# Altium schematic sheet MPU.SchDoc
size A2
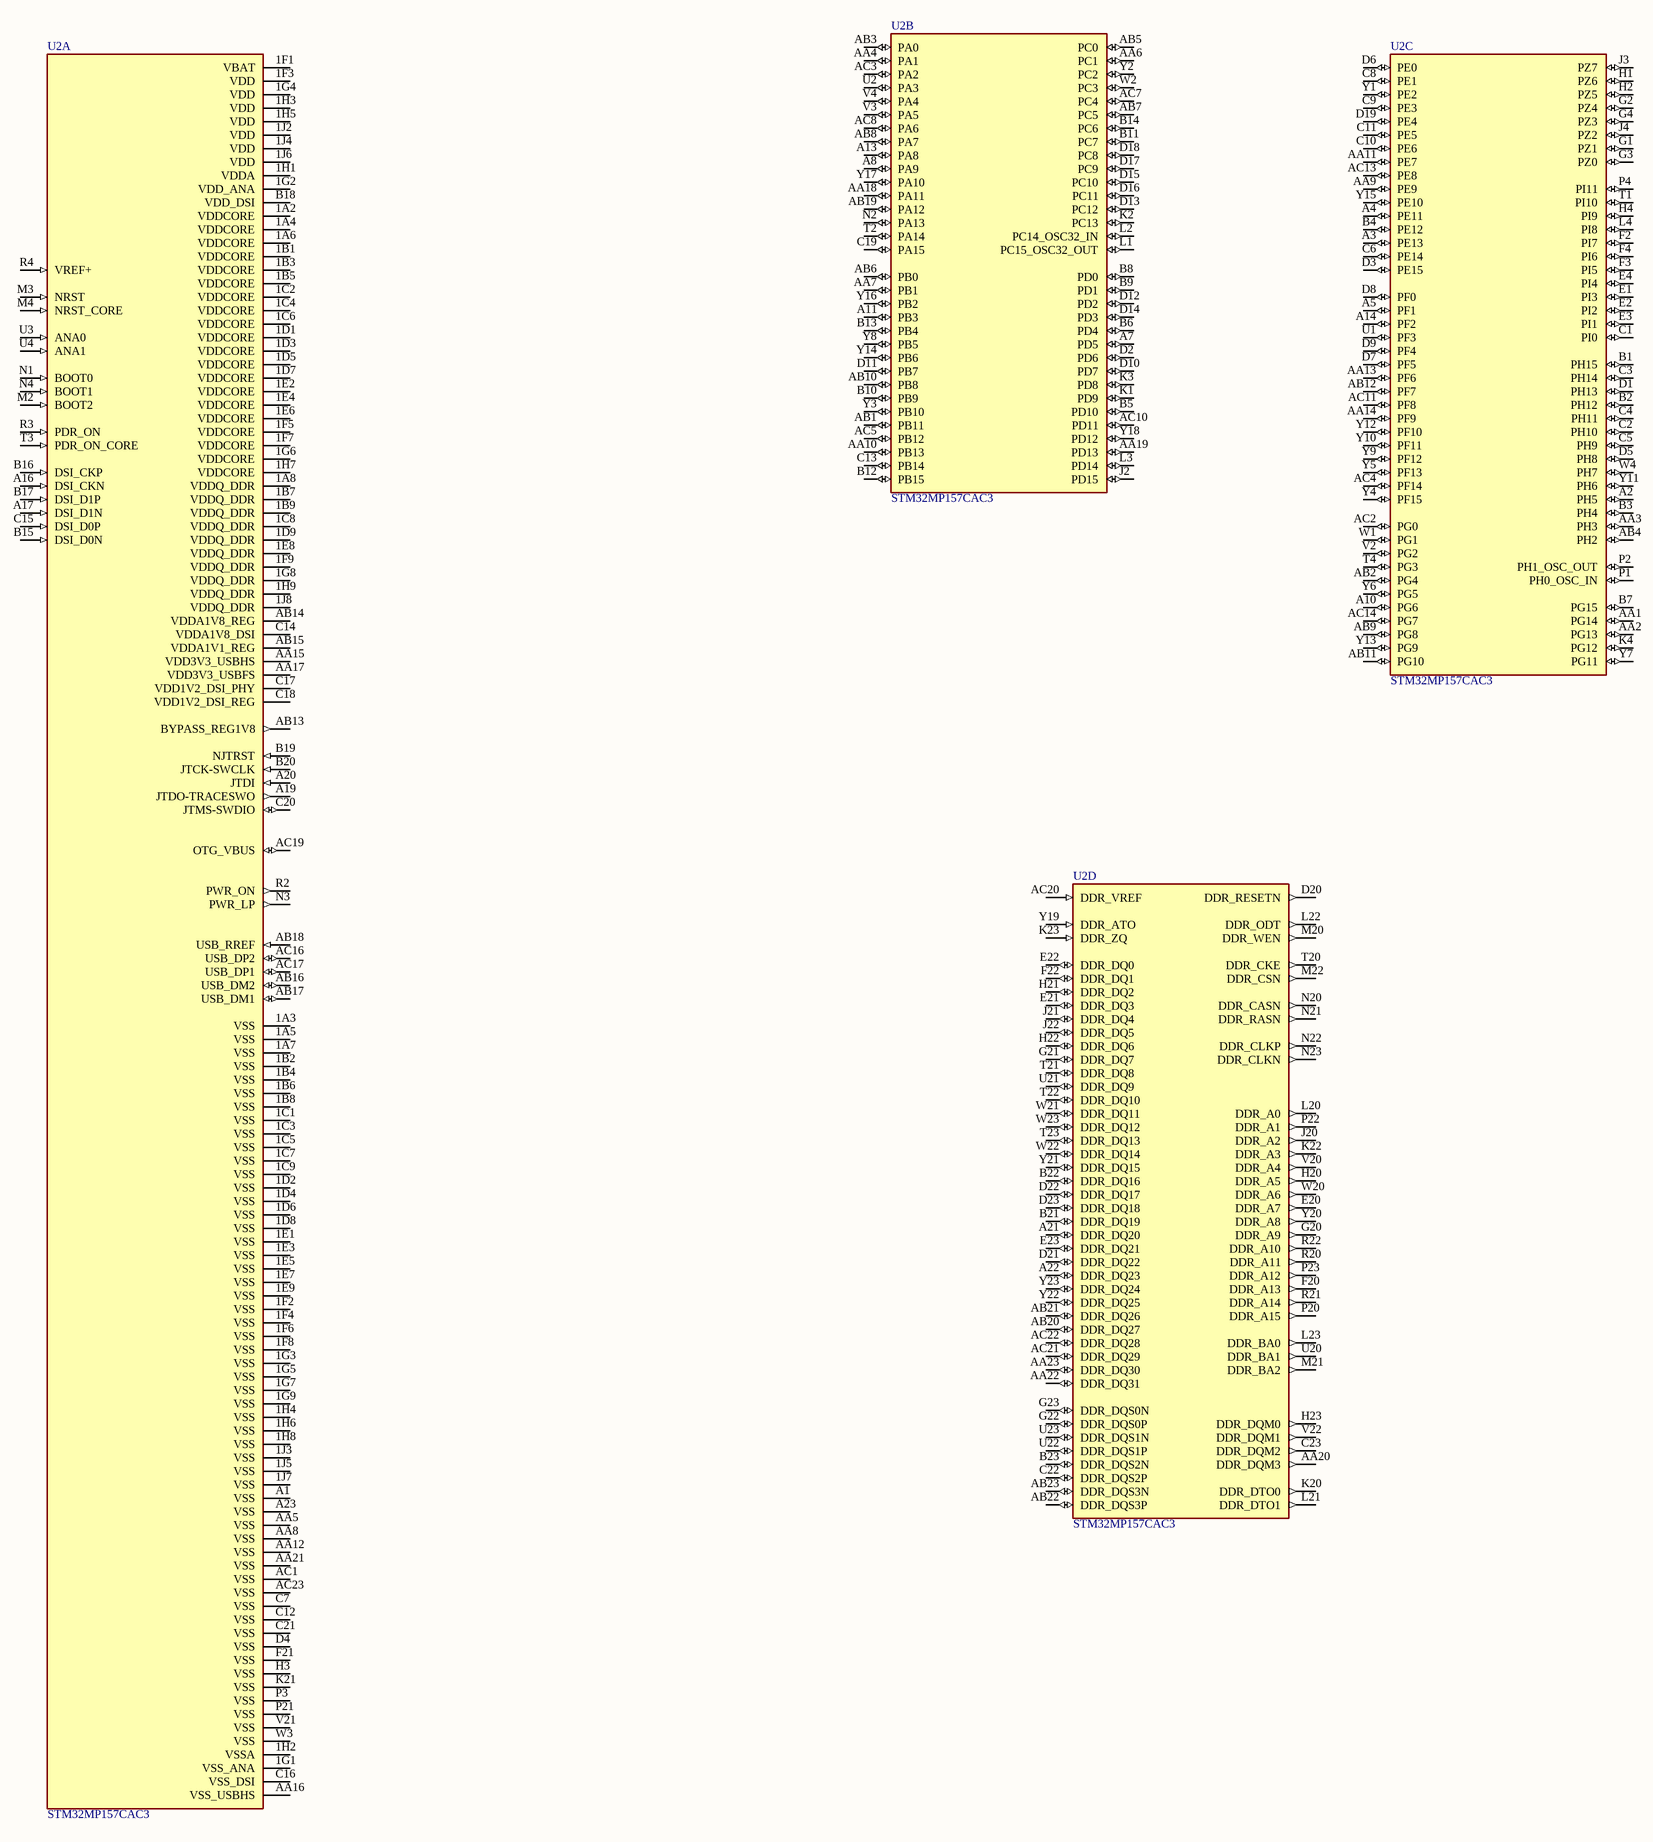
[diagram p0: MPU.SchDoc]

## Parts
U2  STM32MP157CAC3  [STM32MP157CAC3]  (parts A,B,C,D of 4)

## Nets

Not connected (* = marked no-connect by the designer): U2 1A2(VDDCORE) 1A3(VSS) 1A4(VDDCORE) 1A5(VSS) 1A6(VDDCORE) 1A7(VSS) 1A8(VDDQ_DDR) 1B1(VDDCORE) 1B2(VSS) 1B3(VDDCORE) 1B4(VSS) 1B5(VDDCORE) 1B6(VSS) 1B7(VDDQ_DDR) 1B8(VSS) 1B9(VDDQ_DDR) 1C1(VSS) 1C2(VDDCORE) 1C3(VSS) 1C4(VDDCORE) 1C5(VSS) 1C6(VDDCORE) 1C7(VSS) 1C8(VDDQ_DDR) 1C9(VSS) 1D1(VDDCORE) 1D2(VSS) 1D3(VDDCORE) 1D4(VSS) 1D5(VDDCORE) 1D6(VSS) 1D7(VDDCORE) 1D8(VSS) 1D9(VDDQ_DDR) 1E1(VSS) 1E2(VDDCORE) 1E3(VSS) 1E4(VDDCORE) 1E5(VSS) 1E6(VDDCORE) 1E7(VSS) 1E8(VDDQ_DDR) 1E9(VSS) 1F1(VBAT) 1F2(VSS) 1F3(VDD) 1F4(VSS) 1F5(VDDCORE) 1F6(VSS) 1F7(VDDCORE) 1F8(VSS) 1F9(VDDQ_DDR) 1G1(VSS_ANA) 1G2(VDD_ANA) 1G3(VSS) 1G4(VDD) 1G5(VSS) 1G6(VDDCORE) 1G7(VSS) 1G8(VDDQ_DDR) 1G9(VSS) 1H1(VDDA) 1H2(VSSA) 1H3(VDD) 1H4(VSS) 1H5(VDD) 1H6(VSS) 1H7(VDDCORE) 1H8(VSS) 1H9(VDDQ_DDR) 1J2(VDD) 1J3(VSS) 1J4(VDD) 1J5(VSS) 1J6(VDD) 1J7(VSS) 1J8(VDDQ_DDR) A1(VSS) A2(PH5) A3(PE13) A4(PE11) A5(PF1) A7(PD5) A8(PA9) A10(PG6) A11(PB3) A13(PA8) A14(PF2) A16(DSI_CKN) A17(DSI_D1N) A19(JTDO-TRACESWO) A20(JTDI) A21(DDR_DQ20) A22(DDR_DQ23) A23(VSS) AA1(PG14) AA2(PG13) AA3(PH3) AA4(PA1) AA5(VSS) AA6(PC1) AA7(PB1) AA8(VSS) AA9(PE9) AA10(PB13) AA11(PE7) AA12(VSS) AA13(PF6) AA14(PF9) AA15(VDD3V3_USBHS) AA16(VSS_USBHS) AA17(VDD3V3_USBFS) AA18(PA11) AA19(PD13) AA20(DDR_DQM3) AA21(VSS) AA22(DDR_DQ31) AA23(DDR_DQ30) AB1(PB11) AB2(PG4) AB3(PA0) AB4(PH2) AB5(PC0) AB6(PB0) AB7(PC5) AB8(PA7) AB9(PG8) AB10(PB8) AB11(PG10) AB12(PF7) AB13(BYPASS_REG1V8) AB14(VDDA1V8_REG) AB15(VDDA1V1_REG) AB16(USB_DM2) AB17(USB_DM1) AB18(USB_RREF) AB19(PA12) AB20(DDR_DQ27) AB21(DDR_DQ26) AB22(DDR_DQS3P) AB23(DDR_DQS3N) AC1(VSS) AC2(PG0) AC3(PA2) AC4(PF14) AC5(PB12) AC7(PC4) AC8(PA6) AC10(PD11) AC11(PF8) AC13(PE8) AC14(PG7) AC16(USB_DP2) AC17(USB_DP1) AC19(OTG_VBUS) AC20(DDR_VREF) AC21(DDR_DQ29) AC22(DDR_DQ28) AC23(VSS) B1(PH15) B2(PH12) B3(PH4) B4(PE12) B5(PD10) B6(PD4) B7(PG15) B8(PD0) B9(PD1) B10(PB9) B11(PC7) B12(PB15) B13(PB4) B14(PC6) B15(DSI_D0N) B16(DSI_CKP) B17(DSI_D1P) B18(VDD_DSI) B19(NJTRST) B20(JTCK-SWCLK) B21(DDR_DQ19) B22(DDR_DQ16) B23(DDR_DQS2N) C1(PI0) C2(PH10) C3(PH14) C4(PH11) C5(PH9) C6(PE14) C7(VSS) C8(PE1) C9(PE3) C10(PE6) C11(PE5) C12(VSS) C13(PB14) C14(VDDA1V8_DSI) C15(DSI_D0P) C16(VSS_DSI) C17(VDD1V2_DSI_PHY) C18(VDD1V2_DSI_REG) C19(PA15) C20(JTMS-SWDIO) C21(VSS) C22(DDR_DQS2P) C23(DDR_DQM2) D1(PH13) D2(PD6) D3(PE15) D4(VSS) D5(PH8) D6(PE0) D7(PF5) D8(PF0) D9(PF4) D10(PD7) D11(PB7) D12(PD2) D13(PC12) D14(PD3) D15(PC10) D16(PC11) D17(PC9) D18(PC8) D19(PE4) D20(DDR_RESETN) D21(DDR_DQ22) D22(DDR_DQ17) D23(DDR_DQ18) E1(PI3) E2(PI2) E3(PI1) E4(PI4) E20(DDR_A7) E21(DDR_DQ3) E22(DDR_DQ0) E23(DDR_DQ21) F2(PI7) F3(PI5) F4(PI6) F20(DDR_A13) F21(VSS) F22(DDR_DQ1) G1(PZ1) G2(PZ4) G3(PZ0) G4(PZ3) G20(DDR_A9) G21(DDR_DQ7) G22(DDR_DQS0P) G23(DDR_DQS0N) H1(PZ6) H2(PZ5) H3(VSS) H4(PI9) H20(DDR_A5) H21(DDR_DQ2) H22(DDR_DQ6) H23(DDR_DQM0) J2(PD15) J3(PZ7) J4(PZ2) J20(DDR_A2) J21(DDR_DQ4) J22(DDR_DQ5) K1(PD9) K2(PC13) K3(PD8) K4(PG12) K20(DDR_DTO0) K21(VSS) K22(DDR_A3) K23(DDR_ZQ) L1(PC15_OSC32_OUT) L2(PC14_OSC32_IN) L3(PD14) L4(PI8) L20(DDR_A0) L21(DDR_DTO1) L22(DDR_ODT) L23(DDR_BA0) M2(BOOT2) M3(NRST) M4(NRST_CORE) M20(DDR_WEN) M21(DDR_BA2) M22(DDR_CSN) N1(BOOT0) N2(PA13) N3(PWR_LP) N4(BOOT1) N20(DDR_CASN) N21(DDR_RASN) N22(DDR_CLKP) N23(DDR_CLKN) P1(PH0_OSC_IN) P2(PH1_OSC_OUT) P3(VSS) P4(PI11) P20(DDR_A15) P21(VSS) P22(DDR_A1) P23(DDR_A12) R2(PWR_ON) R3(PDR_ON) R4(VREF+) R20(DDR_A11) R21(DDR_A14) R22(DDR_A10) T1(PI10) T2(PA14) T3(PDR_ON_CORE) T4(PG3) T20(DDR_CKE) T21(DDR_DQ8) T22(DDR_DQ10) T23(DDR_DQ13) U1(PF3) U2(PA3) U3(ANA0) U4(ANA1) U20(DDR_BA1) U21(DDR_DQ9) U22(DDR_DQS1P) U23(DDR_DQS1N) V2(PG2) V3(PA5) V4(PA4) V20(DDR_A4) V21(VSS) V22(DDR_DQM1) W1(PG1) W2(PC3) W3(VSS) W4(PH7) W20(DDR_A6) W21(DDR_DQ11) W22(DDR_DQ14) W23(DDR_DQ12) Y1(PE2) Y2(PC2) Y3(PB10) Y4(PF15) Y5(PF13) Y6(PG5) Y7(PG11) Y8(PB5) Y9(PF12) Y10(PF11) Y11(PH6) Y12(PF10) Y13(PG9) Y14(PB6) Y15(PE10) Y16(PB2) Y17(PA10) Y18(PD12) Y19(DDR_ATO) Y20(DDR_A8) Y21(DDR_DQ15) Y22(DDR_DQ25) Y23(DDR_DQ24)

## Library data of the parts
U2 = STM32MP157CAC3: ARM® Cortex®-A7 Microprocessor IC STM32MP1 2 Core, 32-Bit 209MHz, 650MHz 361-TFBGA (12x12); MP: STM32MP157AAC3; MF: STMicroelectronics; Value: *; SnapEDA_Link: https://www.snapeda.com/parts/STM32MP157AAC3/STMicroelectronics/view-part/3660522/?ref=snap; Price: None; Mouser-Purchase-URL: https://snapeda.com/shop?store=Mouser&id=3660522; Package: TFBGA-361 STMicroelectronics; DigiKey-Purchase-URL: https://snapeda.com/shop?store=DigiKey&id=3660522; Availability: Bad